# Altium schematic sheet TX_FM.SchDoc
size A4
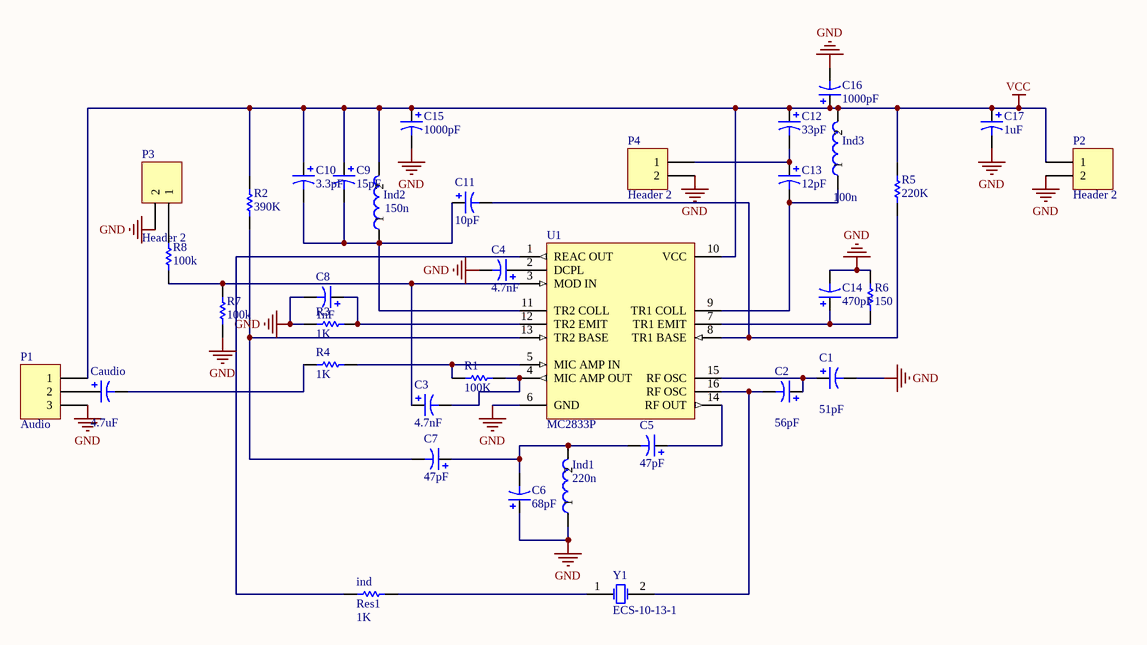
[diagram p0: TX_FM.SchDoc]

## Parts
C1  value 51pF  [C0805]  (hidden comment: Cap Pol3)
C2  value 56pF  [C0805]  (hidden comment: Cap Pol3)
C3  value 4.7nF  [C0805]  (hidden comment: Cap Pol3)
C4  value 4.7nF  [C0805]  (hidden comment: Cap Pol3)
C5  value 47pF  [C0805]  (hidden comment: Cap Pol3)
C6  value 68pF  [C0805]  (hidden comment: Cap Pol3)
C7  value 47pF  [C0805]  (hidden comment: Cap Pol3)
C8  value 1nF  [C0805]  (hidden comment: Cap Pol3)
C9  value 15pF  [C0805]  (hidden comment: Cap Pol3)
C10  value 3.3pF  [C0805]  (hidden comment: Cap Pol3)
C11  value 10pF  [C0805]  (hidden comment: Cap Pol3)
C12  value 33pF  [C0805]  (hidden comment: Cap Pol3)
C13  value 12pF  [C0805]  (hidden comment: Cap Pol3)
C14  value 470pF  [C0805]  (hidden comment: Cap Pol3)
C15  value 1000pF  [C0805]  (hidden comment: Cap Pol3)
C16  value 1000pF  [C0805]  (hidden comment: Cap Pol3)
C17  value 1uF  [C0805]  (hidden comment: Cap Pol3)
Caudio  value 4.7uF  [B]  (hidden comment: Cap Pol1)
ind  Res1  value 1K  [AXIAL-0.3]
Ind1  Valor: 220n  [IND_7MM]  (hidden comment: Ind2)
Ind2  Valor: 150n  [Ind_5mm]  (hidden comment: Ind2)
Ind3  Valor: 100n  [Ind_5mm]  (hidden comment: Ind2)
P1  Audio  [HDR1X3]
P2  Header 2  [HDR1X2]
P3  Header 2  [HDR1X2]
P4  Header 2  [HDR1X2]
R1  value 100K  [2012[0805]]  (hidden comment: Res Semi)
R2  value 390K  [2012[0805]]  (hidden comment: Res Semi)
R3  value 1K  [2012[0805]]  (hidden comment: Res Semi)
R4  value 1K  [2012[0805]]  (hidden comment: Res Semi)
R5  value 220K  [2012[0805]]  (hidden comment: Res Semi)
R6  value 150  [2012[0805]]  (hidden comment: Res Semi)
R7  value 100k  [2012[0805]]  (hidden comment: Res Semi)
R8  value 100k  [2012[0805]]  (hidden comment: Res Semi)
U1  MC2833P  [648-06]
Y1  ECS-10-13-1  [HC-49U]

## Nets
GND: C1.2 C4.2 C6.1 C8.2 C14.2 C15.2 C16.2 C17.2 Ind1.1 P1.3 P2.2 P3.2 P4.2 R3.2 R6.1 R7.2 U1.6(GND)
VCC: C9.1 C10.1 C12.1 C15.1 C16.1 C17.1 Ind2.2 Ind3.2 P1.1 P2.1 R2.2 R5.1 U1.10(VCC)
NetC1_1: C1.1 C2.1 U1.15(RF_OSC)
NetC2_2: C2.2 U1.16(RF_OSC) Y1.2(OSC2)
NetC3_1: C3.1 R7.1 R8.2 U1.3(MOD_IN)
NetC3_2: C3.2 R1.2 U1.4(MIC_AMP_OUT)
NetC4_1: C4.1 U1.2(DCPL)
NetC5_1: C5.1 U1.14(RF_OUT)
NetC5_2: C5.2 C6.2 C7.1 Ind1.2
NetC7_2: C7.2 R2.1 U1.13(TR2_BASE)
NetC8_1: C8.1 R3.1 U1.12(TR2_EMIT)
NetC9_2: C9.2 C10.2 C11.1 Ind2.1 U1.11(TR2_COLL)
NetC11_2: C11.2 R5.2 U1.8(TR1_BASE)
NetC12_2: C12.2 C13.1 P4.1
NetC13_2: C13.2 Ind3.1 U1.9(TR1_COLL)
NetC14_1: C14.1 R6.2 U1.7(TR1_EMIT)
NetCaudio_1: Caudio.1 P1.2
NetCaudio_2: Caudio.2 R4.2
Netind_1: ind.1 U1.1(REAC_OUT)
Netind_2: ind.2 Y1.1(OSC1)
NetP3_1: P3.1 R8.1
NetR1_1: R1.1 R4.1 U1.5(MIC_AMP_IN)

## Library data of the parts
C1-C17 = Cap Pol3: Polarized Capacitor (Surface Mount); Published: 8-Jun-2000; LatestRevisionDate: 17-Jul-2002; LatestRevisionNote: Re-released for DXP Platform.; PackageReference: C0805; Publisher: Altium Limited
Caudio = Cap Pol1: Polarized Capacitor (Radial); Published: 8-Jun-2000; LatestRevisionDate: 17-Jul-2002; LatestRevisionNote: Re-released for DXP Platform.; PackageReference: RB7.6-15; Publisher: Altium Limited
ind = Res1: Resistor; Published: 8-Jun-2000; LatestRevisionDate: 17-Jul-2002; LatestRevisionNote: Re-released for DXP Platform.; PackageReference: AXIAL-0.3; Publisher: Altium Limited
P1 = Header 3: Header, 3-Pin; LatestRevisionDate: 17-Jul-2002; LatestRevisionNote: Re-released for DXP Platform.; Publisher: Altium Limited
P2-P4 = Header 2: Header, 2-Pin; LatestRevisionDate: 17-Jul-2002; LatestRevisionNote: Re-released for DXP Platform.; Publisher: Altium Limited
R1-R8 = Res Semi: Semiconductor Resistor; Published: 8-Jun-2000; LatestRevisionDate: 17-Jul-2002; LatestRevisionNote: Re-released for DXP Platform.; PackageReference: AXIAL-0.5; Publisher: Altium Limited
U1 = MC2833P: Low Power FM Transmitter System; Published: 17-Jul-2002; LatestRevisionDate: 06-Jun-2005; LatestRevisionNote: Stylized 3D Model Added.; DatasheetDocument: 1988; PackageReference: 648-06; Publisher: Altium Limited; ComponentLink1Description: Manufacturer Link; ComponentLink1URL: http://www.motorola.com/
Y1 = ECS-10-13-1: Crystal Oscillator; Published: 17-Jul-2002; DatasheetDocument: 18-Apr-2000; PackageReference: HC-49U; Publisher: Altium Limited; ComponentLink1Description: Manufacturer Link; ComponentLink1URL: http://www.ecsxtal.com/; ComponentLink2Description: Datasheet; ComponentLink2URL: http://www.ecsxtal.com/pdf2/HC49U.PDF